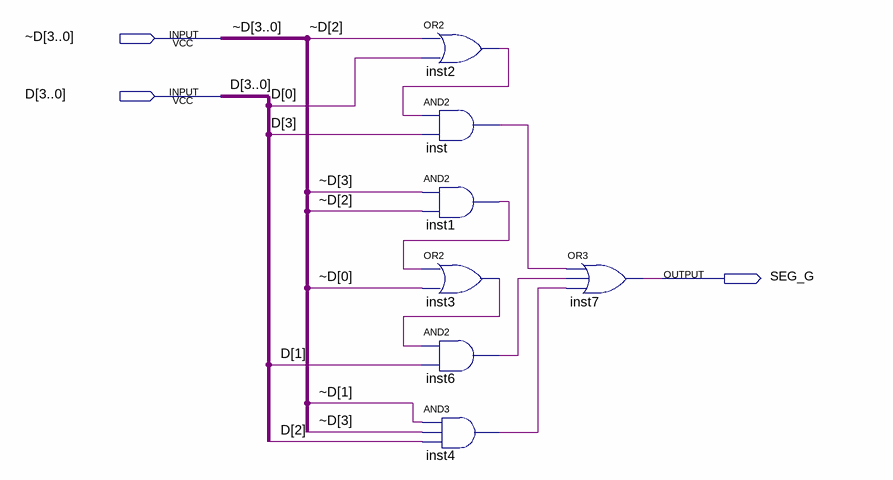
[diagram p0: schematic sheet]
// Quartus schematic SEG_G.bdf as structural Verilog: 7 symbols, 3 pins
module SEG_G (
  input  [3:0] \~D ,
  input  [3:0] D,
  output SEG_G
);

  wire inst1_out, inst2_out, inst3_out, inst4_out, inst6_out, inst_out;

  or inst2 (inst2_out, \~D [2], D[0]);
  and inst (inst_out, inst2_out, D[3]);
  and inst1 (inst1_out, \~D [3], \~D [2]);
  or inst3 (inst3_out, inst1_out, \~D [0]);
  and inst6 (inst6_out, inst3_out, D[1]);
  and inst4 (inst4_out, \~D [1], \~D [3], D[2]);
  or inst7 (SEG_G, inst_out, inst6_out, inst4_out);
endmodule
